# Altium schematic sheet Sheet1.SchDoc
size A4; SheetNumber: 2; SheetTotal: 2
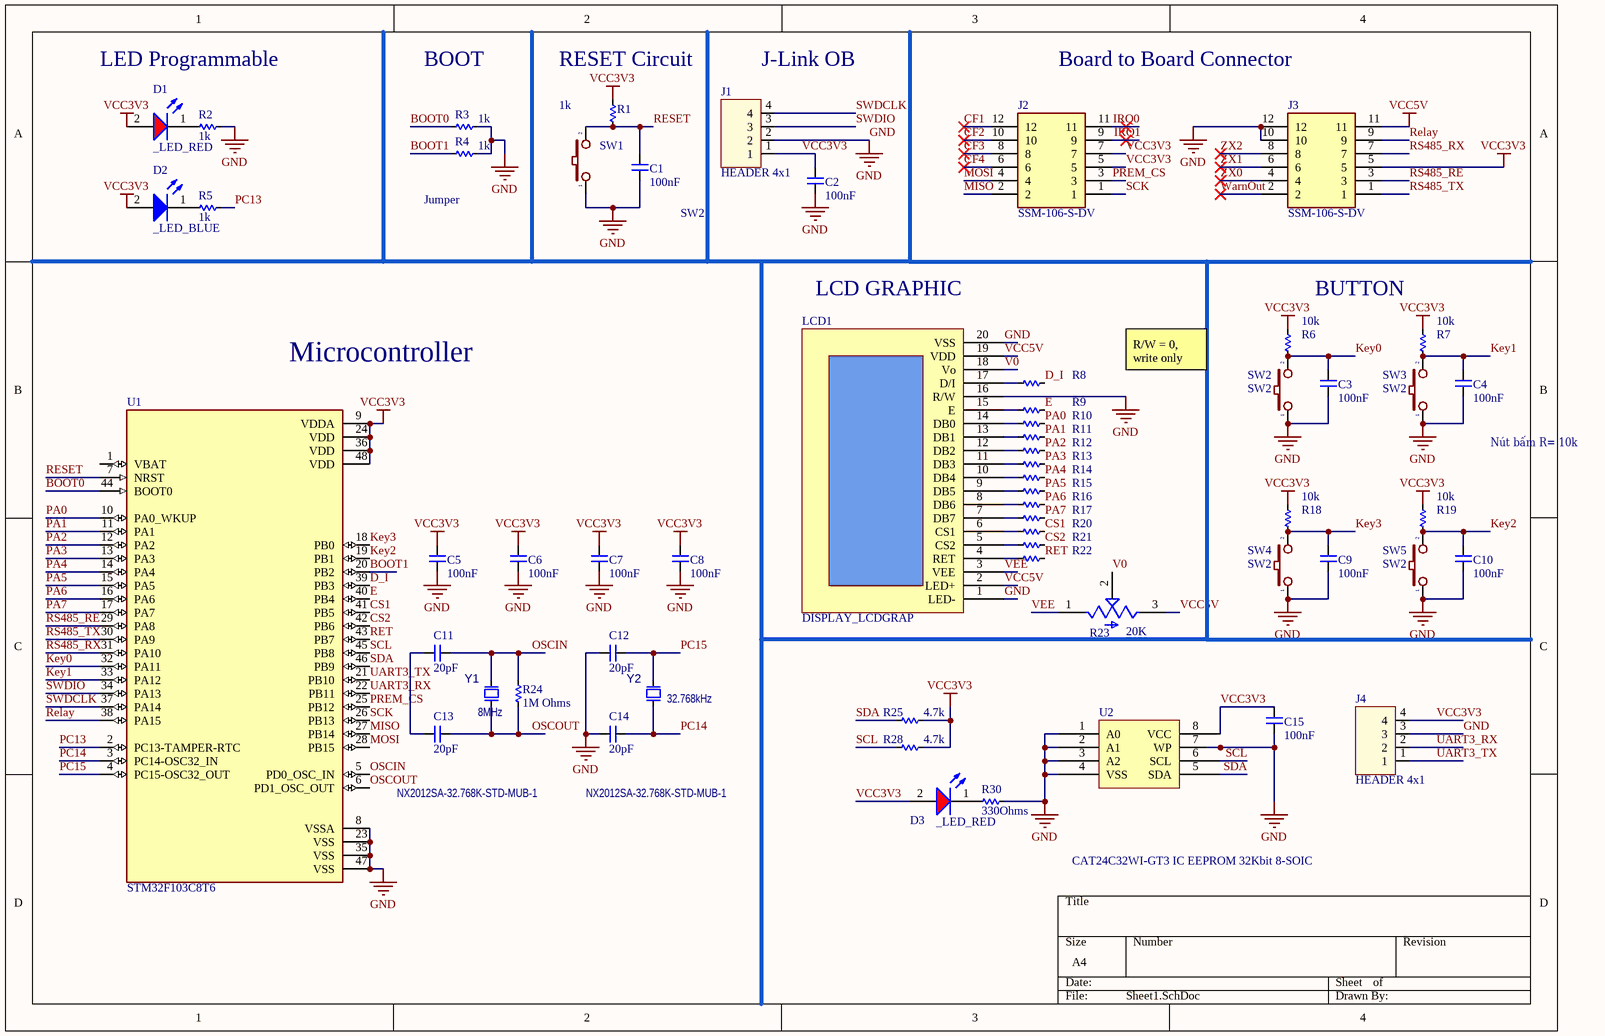
[diagram p0: Sheet1.SchDoc]

## Parts
C1  100nF  [CAP_C_2012X110]
C2  100nF  [CAP_C_2012X110]
C3  100nF  [CAP_C_2012X110]
C4  100nF  [CAP_C_2012X110]
C5  100nF  [CAP_C_2012X110]
C6  100nF  [CAP_C_2012X110]
C7  100nF  [CAP_C_2012X110]
C8  100nF  [CAP_C_2012X110]
C9  100nF  [CAP_C_2012X110]
C10  100nF  [CAP_C_2012X110]
C11  20pF  [CAP_C_2012X110]
C12  20pF  [CAP_C_2012X110]
C13  20pF  [CAP_C_2012X110]
C14  20pF  [CAP_C_2012X110]
C15  100nF  [CAP_C_2012X110]
D1  _LED_RED  [LED_0603]
D2  _LED_BLUE  [LED_0603]
D3  _LED_RED  [LED_0603]
J1  HEADER 4x1  [Header_254P_4x1]
J2  SSM-106-S-DV  [SSM-105-XXX-DV-BE]
J3  SSM-106-S-DV  [SSM-105-XXX-DV-BE]
J4  HEADER 4x1  [Header_254P_4x1]
LCD1  DISPLAY_LCDGRAP  [LCD_GRAP_20PIN]
R1  1k  [RES_C_2012X65]
R2  1k  [RES_C_2012X65]
R3  1k  [RES_C_2012X65]
R4  1k  [RES_C_2012X65]
R5  1k  [RES_C_2012X65]
R6  10k  [RES_C_2012X65]
R7  10k  [RES_C_2012X65]
R8  1k  [RES_C_2012X65]  (value not drawn)
R9  1k  [RES_C_2012X65]  (value not drawn)
R10  1k  [RES_C_2012X65]  (value not drawn)
R11  1k  [RES_C_2012X65]  (value not drawn)
R12  1k  [RES_C_2012X65]  (value not drawn)
R13  1k  [RES_C_2012X65]  (value not drawn)
R14  1k  [RES_C_2012X65]  (value not drawn)
R15  1k  [RES_C_2012X65]  (value not drawn)
R16  1k  [RES_C_2012X65]  (value not drawn)
R17  1k  [RES_C_2012X65]  (value not drawn)
R18  10k  [RES_C_2012X65]
R19  10k  [RES_C_2012X65]
R20  1k  [RES_C_2012X65]  (value not drawn)
R21  1k  [RES_C_2012X65]  (value not drawn)
R22  1k  [RES_C_2012X65]  (value not drawn)
R23  20K  [TRIM_TC33X-2-103E]
R24  1M Ohms  [RES_C_2012X65]
R25  4.7k  [RES_C_1608X60]
R28  4.7k  [RES_C_1608X60]
R30  330Ohms  [RES_C_1608X60]
SW1  SW2  [SW2-SMD]
SW2  SW2  [SW2-SMD]
SW3  SW2  [SW2-SMD]
SW4  SW2  [SW2-SMD]
SW5  SW2  [SW2-SMD]
U1  STM32F103C8T6  [QFP50P900X900X160-48N]
U2  CAT24C32WI-GT3 IC EEPROM 32Kbit 8-SOIC  [SOP8]
Y1  value 8MHz  Manufacturer Part Number 1: NX2012SA-32.768K-STD-MUB-1  [CRYSTAL_NX2012SA]  (hidden comment: Crystal 2 Pins)
Y2  value 32.768kHz  Manufacturer Part Number 1: NX2012SA-32.768K-STD-MUB-1  [CRYSTAL_NX2012SA]  (hidden comment: Crystal 2 Pins)

## Nets
GND: C1.1 C2.1 C3.1 C4.1 C5.1 C6.1 C7.1 C8.1 C9.1 C10.1 C12.1 C14.1 C15.1 J1.2 J3.10 J3.12 J4.3 LCD1.1(LED-) LCD1.16(R/W) LCD1.20(VSS) R2.2 R3.2 R4.2 R30.2 SW1.1 SW2.1 SW3.1 SW4.1 SW5.1 U1.8(VSSA) U1.23(VSS) U1.35(VSS) U1.47(VSS) U2.1(A0) U2.2(A1) U2.3(A2) U2.4(VSS) U2.7(WP)
VCC3V3: C2.2 C5.2 C6.2 C7.2 C8.2 C15.2 D1.2(A) D2.2(A) D3.2(A) J1.1 J2.5 J2.7 J3.5 J4.4 R1.2 R6.2 R7.2 R18.2 R19.2 R25.2 R28.2 U1.9(VDDA) U1.24(VDD) U1.36(VDD) U1.48(VDD) U2.8(VCC)
VCC5V: J3.11 LCD1.2(LED+) LCD1.19(VDD) R23.3(CW)
BOOT0: R3.1 U1.44(BOOT0)
BOOT1: R4.1 U1.20(PB2)
CF1: J2.12
CF2: J2.10
CF3: J2.8
CF4: J2.6
CS1: R20.2 U1.41(PB5)
CS2: R21.2 U1.42(PB6)
D_I: R8.2 U1.39(PB3)
E: R9.2 U1.40(PB4)
IRQ0: J2.11
IRQ1: J2.9
Key0: C3.2 R6.1 SW2.2 U1.32(PA11)
Key1: C4.2 R7.1 SW3.2 U1.33(PA12)
Key2: C10.2 R19.1 SW5.2 U1.19(PB1)
Key3: C9.2 R18.1 SW4.2 U1.18(PB0)
MISO: J2.2 U1.27(PB14)
MOSI: J2.4 U1.28(PB15)
OSCIN: C11.2 R24.2 U1.5(PD0_OSC_IN) Y1.2(Osc2)
OSCOUT: C13.2 R24.1 U1.6(PD1_OSC_OUT) Y1.1(Osc1)
PA0: R10.2 U1.10(PA0_WKUP)
PA1: R11.2 U1.11(PA1)
PA2: R12.2 U1.12(PA2)
PA3: R13.2 U1.13(PA3)
PA4: R14.2 U1.14(PA4)
PA5: R15.2 U1.15(PA5)
PA6: R16.2 U1.16(PA6)
PA7: R17.2 U1.17(PA7)
PC13: R5.2 U1.2(PC13-TAMPER-RTC)
PC14: C14.2 U1.3(PC14-OSC32_IN) Y2.1(Osc1)
PC15: C12.2 U1.4(PC15-OSC32_OUT) Y2.2(Osc2)
PREM_CS: J2.3 U1.25(PB12)
Relay: J3.9 U1.38(PA15)
RESET: C1.2 R1.1 SW1.2 U1.7(NRST)
RET: R22.2 U1.43(PB7)
RS485_RE: J3.3 U1.29(PA8)
RS485_RX: J3.7 U1.31(PA10)
RS485_TX: J3.1 U1.30(PA9)
SCK: J2.1 U1.26(PB13)
SCL: R28.1 U1.45(PB8) U2.6(SCL)
SDA: R25.1 U1.46(PB9) U2.5(SDA)
SWDCLK: J1.4 U1.37(PA14)
SWDIO: J1.3 U1.34(PA13)
UART3_RX: J4.2 U1.22(PB11)
UART3_TX: J4.1 U1.21(PB10)
V0: LCD1.18(Vo) R23.2(W)
VEE: LCD1.3(VEE) R23.1(CCW)
WarnOut: J3.2
ZX0: J3.4
ZX1: J3.6
ZX2: J3.8
NetC11_1: C11.1 C13.1
NetD1_1: D1.1(K) R2.1
NetD2_1: D2.1(K) R5.1
NetD3_1: D3.1(K) R30.1
NetLCD1_4: LCD1.4(RET) R22.1
NetLCD1_5: LCD1.5(CS2) R21.1
NetLCD1_6: LCD1.6(CS1) R20.1
NetLCD1_7: LCD1.7(DB7) R17.1
NetLCD1_8: LCD1.8(DB6) R16.1
NetLCD1_9: LCD1.9(DB5) R15.1
NetLCD1_10: LCD1.10(DB4) R14.1
NetLCD1_11: LCD1.11(DB3) R13.1
NetLCD1_12: LCD1.12(DB2) R12.1
NetLCD1_13: LCD1.13(DB1) R11.1
NetLCD1_14: LCD1.14(DB0) R10.1
NetLCD1_15: LCD1.15(E) R9.1
NetLCD1_17: LCD1.17(D/I) R8.1

Not connected (* = marked no-connect by the designer): U1 1(VBAT)

## Notes on the sheet
- LED Programmable
- BOOT
- (near R1) RESET Circuit
- (near J1) J-Link OB
- Board to Board Connector
- (near R4) Jumper
- (near LCD1) LCD GRAPHIC
- BUTTON
- Microcontroller
- R/W = 0,  write only
- Nút bấm R= 10k

## Library data of the parts
C1-C15 = _CAP_C_2: CAP
J2 J3 = SSM-106-S-DV: Connector; Manufacturer_Name: SAMTEC; Manufacturer_Part_Number: SSM-105-S-DV; Datasheet Link: https://mm.digikey.com/Volume0/opasdata/d220001/medias/docus/6129/ssm-1xx-xxx-dv-xx-xx-xxx-x-xx-mkt.pdf; Mouser Part Number: 200-SSM105SDV; Mouser Price/Stock: https://www.mouser.co.uk/ProductDetail/Samtec/SSM-105-S-DV?qs=XtX6y9BSeMiNY1vJI%2FFCQQ%3D%3D; Arrow Part Number: SSM-105-S-DV; Arrow Price/Stock: https://www.arrow.com/en/products/ssm-105-s-dv/samtec; LCSC Part #: *
LCD1 = DISPLAY_LCDGRAP: Display 128x64pixel; Manufacturer: Newhaven Display; Manufacturer Part Number: NHD-12864AZ-NSW-BBW-TR; Supplier: Digikey; Supplier Part Number: NHD-12864AZ-NSW-BBW-TR-ND; RoHS: No; Category: LCD, OLED, Graphic Displays; Stock: 303; Pricing: 1=31,34, 5=29,46, 10=27,579, 50=26,0124, 100=24,7588, 250=23,50516 (USD); ComponentLink1URL: https://datasheet.ciiva.com:443/pdfs/VipMasterIC/IC/NWAL/NWALS00082/NWALS00082-1.pdf?src-supplier=IHS+Markit; ComponentLink1Description: https://datasheet.ciiva.com:443/pdfs/VipMasterIC/IC/NWAL/NWALS00082/NWALS00082-1.pdf?src-supplier=IHS+Markit; ComponentLink2URL: https://datasheet.ciiva.com/2102/nhd-12864az-nsw-bbw-tr-2102907.pdf?src-supplier=Digikey; ComponentLink2Description: https://datasheet.ciiva.com/2102/nhd-12864az-nsw-bbw-tr-2102907.pdf?src-supplier=Digikey; ComponentLink3URL: https://datasheet.ciiva.com/16231/nhd-12864az-nsw-bbw-tr-16231892.pdf?src-supplier=Onlinecomponents.com; ComponentLink3Description: https://datasheet.ciiva.com/16231/nhd-12864az-nsw-bbw-tr-16231892.pdf?src-supplier=Onlinecomponents.com; ComponentLink4URL: https://datasheet.ciiva.com/5326/nhd-12864az-nsw-bbw-tr-52487-5326437.pdf?src-supplier=Mouser; ComponentLink4Description: https://datasheet.ciiva.com/5326/nhd-12864az-nsw-bbw-tr-52487-5326437.pdf?src-supplier=Mouser; ComponentLink5URL: https://datasheet.ciiva.com/30204/nhd-12864az-nsw-bbw-tr-30204634.pdf?src-supplier=Onlinecomponents.com; ComponentLink5Description: https://datasheet.ciiva.com/30204/nhd-12864az-nsw-bbw-tr-30204634.pdf?src-supplier=Onlinecomponents.com
R1-R22 R24 = _RES_B_2: RES
R23 = TC33X-2-103E: 10 kOhms 0.1W, 1/10W J Lead Surface Mount Trimmer Potentiometer Cermet 1 Turn Top Adjustment; MF: Bourns; MP: TC33X-2-103E; SnapEDA_Link: https://www.snapeda.com/parts/TC33X-2-103E/Bourns/view-part/47092/?ref=snap; Package: SOD-23 Bourns; Check_prices: https://www.snapeda.com/parts/TC33X-2-103E/Bourns/view-part/47092/?ref=eda; Value: *; Purchase-URL: https://pricing.snapeda.com/search/part/TC33X-2-103E/?ref=eda; Digi-Key_Part_Number: TC33X-103ECT-ND
R25 R28 R30 = _RES_B_2_1: RES
SW1-SW5 = SW2: Switch button 2 pin; pin to pad: 1>1+4 2>2+3; Value: SW chip 2 pin
U1 = STM32F103C8T6: ARM® Cortex®-M3 STM32F1 Microcontroller IC 32-Bit 72MHz 64KB (64K x 8) FLASH 48-LQFP (7x7); MF: STMicroelectronics; SnapEDA_Link: https://www.snapeda.com/parts/STM32F103C8T6/STMicroelectronics/view-part/?ref=snap; Package: LQFP-48 STMicroelectronics; Value: *; MP: STM32F103C8T6; Check_prices: https://www.snapeda.com/parts/STM32F103C8T6/STMicroelectronics/view-part/?ref=eda
Y1 Y2 = OSC_32.768kHz: Crystal; Manufacturer 1: NDK; MCHP-ID: OSC1092; Description_: CRYSTAL 32.768kHz 12.5pF SMD NX2012SA; Dev Tools Status: Production; Owner: Jamus Griego; Tolerance: ±20ppm; Load Capacitance: 12.5pF; Populated: YES; Revision: 1; Symbol: Crystal 2 Pins; Status: MCL Design; ComponentLink1URL: https://chn-vm-apps.microchip.com/mchprepo/parts/Datasheets/c_NX2012SA-STD-MUB-1_e.pdf; ComponentLink1Description: SVN Datasheet; ComponentLink2URL: C:\ALTIUM_WORK\00001_MCHP-CDB\Datasheets\c_NX2012SA-STD-MUB-1_e.pdf; ComponentLink2Description: Local Datasheet; ComponentLink3URL: C:\ALTIUM_WORK\00001_MCHP-CDB\Library\LibraryRefs\Crystal 2 Pins.SchLib; ComponentLink3Description: Open Symbol; ComponentLink4URL: C:\ALTIUM_WORK\00001_MCHP-CDB\Library\Footprints\CRYSTAL_NX2012SA.PcbLib; ComponentLink4Description: Open Footprint; ComponentLink5Description: Open Footprint 2; ComponentLink6Description: Open Footprint 3; ComponentLink7Description: Open Footprint 4; Type: Crystal; Category: Crystal/Oscillator; Supplier 1: Digi-Key; Supplier Part Number 1: 644-1219-1-ND; Quantity Override: 1